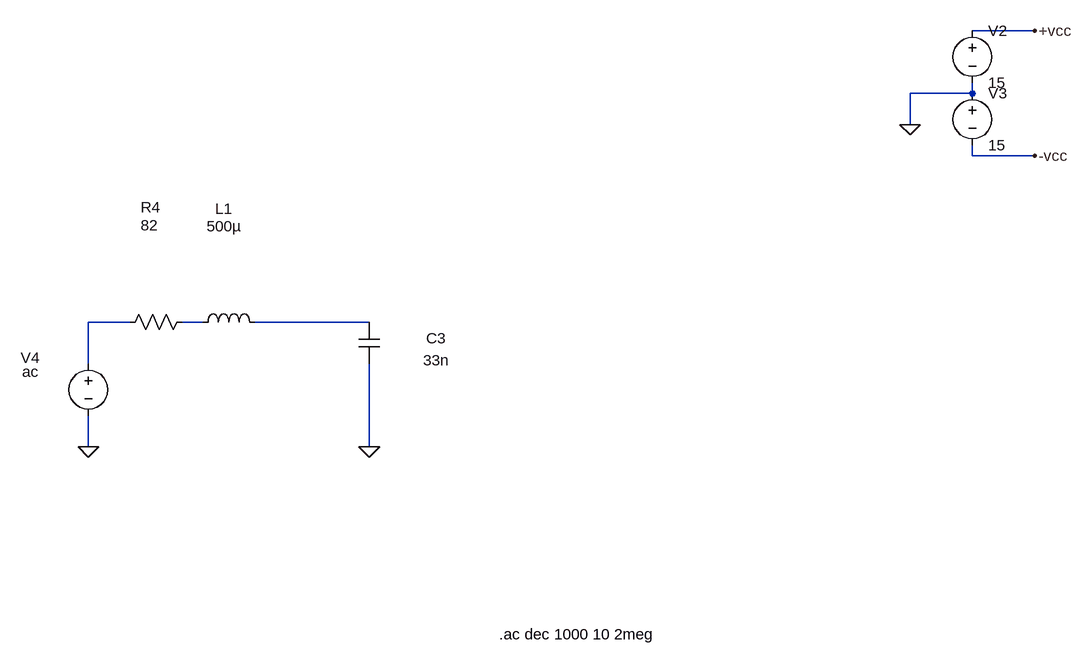
[diagram p0: schematic BR.asc]
BR.asc, the LTspice schematic file:
Version 4
SHEET 1 1204 680
WIRE 816 -368 720 -368
WIRE 720 -272 720 -288
WIRE 720 -272 624 -272
WIRE 624 -224 624 -272
WIRE 720 -176 720 -192
WIRE 816 -176 720 -176
WIRE -576 80 -640 80
WIRE -464 80 -496 80
WIRE -208 80 -384 80
WIRE -640 144 -640 80
WIRE -640 272 -640 224
WIRE -208 272 -208 144
FLAG 816 -368 +vcc
FLAG 816 -176 -vcc
FLAG 624 -224 0
FLAG -640 272 0
FLAG -208 272 0
SYMBOL voltage 720 -384 R0
SYMATTR InstName V2
SYMATTR Value 15
SYMBOL voltage 720 -288 R0
SYMATTR InstName V3
SYMATTR Value 15
SYMBOL voltage -640 128 R0
WINDOW 123 0 0 Left 0
WINDOW 39 0 0 Left 0
WINDOW 0 -104 7 Left 2
WINDOW 3 -102 28 Left 2
SYMATTR InstName V4
SYMATTR Value ac
SYMBOL res -480 64 R90
WINDOW 0 -145 64 VBottom 2
WINDOW 3 -149 66 VTop 2
SYMATTR InstName R4
SYMATTR Value 82
SYMBOL ind -480 96 R270
WINDOW 0 175 49 VTop 2
WINDOW 3 179 49 VBottom 2
SYMATTR InstName L1
SYMATTR Value 500µ
SYMBOL cap -224 80 R0
WINDOW 0 104 25 Left 2
WINDOW 3 99 59 Left 2
SYMATTR InstName C3
SYMATTR Value 33n
TEXT -8 560 Left 2 !.ac dec 1000 10 2meg

The netlist it stands for:
* BR.asc
V2 +vcc 0 15
V3 0 -vcc 15
V4 N001 0 ac
R4 N002 N001 82
L1 N002 N003 500µ
C3 N003 0 33n
.ac dec 1000 10 2meg
.backanno
.end